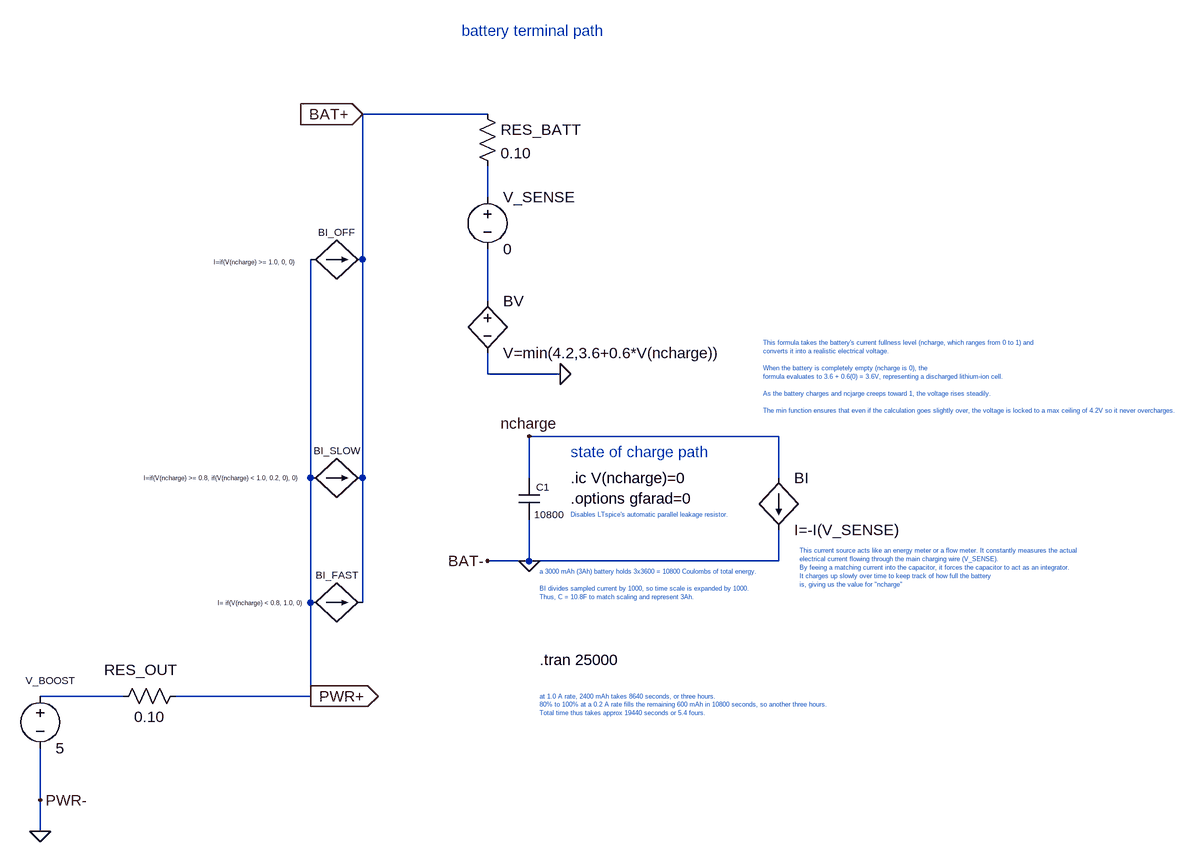
[diagram p0: schematic Charger_ncharge_version1asc.asc]
Charger_ncharge_version1asc.asc, the LTspice schematic file:
Version 4.1
SHEET 1 3040 1292
WIRE 976 144 784 144
WIRE 976 272 976 224
WIRE 784 368 784 144
WIRE 976 432 976 352
WIRE 976 544 976 512
WIRE 1088 544 976 544
WIRE 1424 640 1040 640
WIRE 704 704 704 368
WIRE 784 704 784 368
WIRE 1040 704 1040 640
WIRE 1424 704 1424 640
WIRE 1040 832 1040 768
WIRE 1040 832 976 832
WIRE 1424 832 1424 784
WIRE 1424 832 1040 832
WIRE 704 896 704 704
WIRE 784 896 784 704
WIRE 416 1040 288 1040
WIRE 704 1040 704 896
WIRE 704 1040 496 1040
WIRE 288 1200 288 1120
WIRE 288 1248 288 1200
FLAG 704 1040 PWR+
IOPIN 704 1040 Out
FLAG 288 1248 0
FLAG 288 1200 PWR-
FLAG 784 144 BAT+
IOPIN 784 144 In
FLAG 1040 640 ncharge
FLAG 1040 832 0
FLAG 976 832 BAT-
FLAG 1088 544 0
SYMBOL bi 704 896 R270
WINDOW 0 32 40 VTop 1
WINDOW 3 6 -78 VBottom 0
SYMATTR InstName BI_FAST
SYMATTR Value I= if(V(ncharge) < 0.8, 1.0, 0)
SYMBOL bi 704 704 R270
WINDOW 0 32 40 VTop 1
WINDOW 3 0 -138 VCenter 0
SYMATTR InstName BI_SLOW
SYMATTR Value I=if(V(ncharge) >= 0.8, if(V(ncharge) < 1.0, 0.2, 0), 0)
SYMBOL bi 704 368 R270
WINDOW 0 32 40 VTop 1
WINDOW 3 3 -87 VBottom 0
SYMATTR InstName BI_OFF
SYMATTR Value I=if(V(ncharge) >= 1.0, 0, 0)
SYMBOL voltage 288 1024 R0
WINDOW 0 15 2 Bottom 1
SYMATTR InstName V_BOOST
SYMATTR Value 5
SYMBOL res 512 1024 R90
WINDOW 0 -9 69 VBottom 2
WINDOW 3 32 56 VTop 2
SYMATTR InstName RES_OUT
SYMATTR Value 0.10
SYMBOL bv 976 416 R0
SYMATTR InstName BV
SYMATTR Value V=min(4.2,3.6+0.6*V(ncharge))
SYMBOL res 960 128 R0
SYMATTR InstName RES_BATT
SYMATTR Value 0.10
SYMBOL cap 1024 704 R0
WINDOW 0 27 14 Left 1
WINDOW 3 24 56 Left 1
SYMATTR InstName C1
SYMATTR Value 10800
SYMBOL bi 1424 704 R0
SYMATTR InstName BI
SYMATTR Value I=-I(V_SENSE)
SYMBOL voltage 976 256 R0
SYMATTR InstName V_SENSE
SYMATTR Value 0
TEXT 1104 704 Left 2 !.ic V(ncharge)=0
TEXT 936 16 Left 2 ;battery terminal path
TEXT 1104 664 Left 2 ;state of charge path
TEXT 1056 984 Left 2 !.tran 25000
TEXT 1056 848 Left 0 ;a 3000 mAh (3Ah) battery holds 3x3600 = 10800 Coulombs of total energy.\n \nBI divides sampled current by 1000, so time scale is expanded by 1000. \nThus, C = 10.8F to match scaling and represent 3Ah.
TEXT 1056 1040 Left 0 ;at 1.0 A rate, 2400 mAh takes 8640 seconds, or three hours.\n80% to 100% at a 0.2 A rate fills the remaining 600 mAh in 10800 seconds, so another three hours.\nTotal time thus takes approx 19440 seconds or 5.4 fours.
TEXT 1456 816 Left 0 ;This current source acts like an energy meter or a flow meter. It constantly measures the actual\nelectrical current flowing through the main charging wire (V_SENSE).\nBy feeing a matching current into the capacitor, it forces the capacitor to act as an integrator.\nIt charges up slowly over time to keep track of how full the battery\nis, giving us the value for "ncharge"
TEXT 1104 736 Left 2 !.options gfarad=0
TEXT 1104 760 Left 0 ;Disables LTspice's automatic parallel leakage resistor.
TEXT 1400 496 Left 0 ;This formula takes the battery's current fullness level (ncharge, which ranges from 0 to 1) and\nconverts it into a realistic electrical voltage.\n \nWhen the battery is completely empty (ncharge is 0), the\nformula evaluates to 3.6 + 0.6(0) = 3.6V, representing a discharged lithium-ion cell.\n \nAs the battery charges and ncjarge creeps toward 1, the voltage rises steadily.\n \nThe min function ensures that even if the calculation goes slightly over, the voltage is locked to a max ceiling of 4.2V so it never overcharges.

The netlist it stands for:
* Charger_ncharge_version1asc.asc
BI_FAST PWR+ BAT+ I= if(V(ncharge) < 0.8, 1.0, 0)
BI_SLOW PWR+ BAT+ I=if(V(ncharge) >= 0.8, if(V(ncharge) < 1.0, 0.2, 0), 0)
BI_OFF PWR+ BAT+ I=if(V(ncharge) >= 1.0, 0, 0)
V_BOOST N003 0 5
RES_OUT PWR+ N003 0.10
BV N002 0 V=min(4.2,3.6+0.6*V(ncharge))
RES_BATT BAT+ N001 0.10
C1 ncharge 0 10800
BI ncharge 0 I=-I(V_SENSE)
V_SENSE N001 N002 0
.ic V(ncharge)=0
* battery terminal path
* state of charge path
.tran 25000
* a 3000 mAh (3Ah) battery holds 3x3600 = 10800 Coulombs of total energy.
* BI divides sampled current by 1000, so time scale is expanded by 1000.
* Thus, C = 10.8F to match scaling and represent 3Ah.
* at 1.0 A rate, 2400 mAh takes 8640 seconds, or three hours.
* 80% to 100% at a 0.2 A rate fills the remaining 600 mAh in 10800 seconds, so another three hours.
* Total time thus takes approx 19440 seconds or 5.4 fours.
* This current source acts like an energy meter or a flow meter. It constantly measures the actual
* electrical current flowing through the main charging wire (V_SENSE).
* By feeing a matching current into the capacitor, it forces the capacitor to act as an integrator.
* It charges up slowly over time to keep track of how full the battery
* is, giving us the value for "ncharge"
.options gfarad=0
* Disables LTspice's automatic parallel leakage resistor.
* This formula takes the battery's current fullness level (ncharge, which ranges from 0 to 1) and
* converts it into a realistic electrical voltage.
* When the battery is completely empty (ncharge is 0), the
* formula evaluates to 3.6 + 0.6(0) = 3.6V, representing a discharged lithium-ion cell.
* As the battery charges and ncjarge creeps toward 1, the voltage rises steadily.
* The min function ensures that even if the calculation goes slightly over, the voltage is locked to a max ceiling of 4.2V so it never overcharges.
.backanno
.end